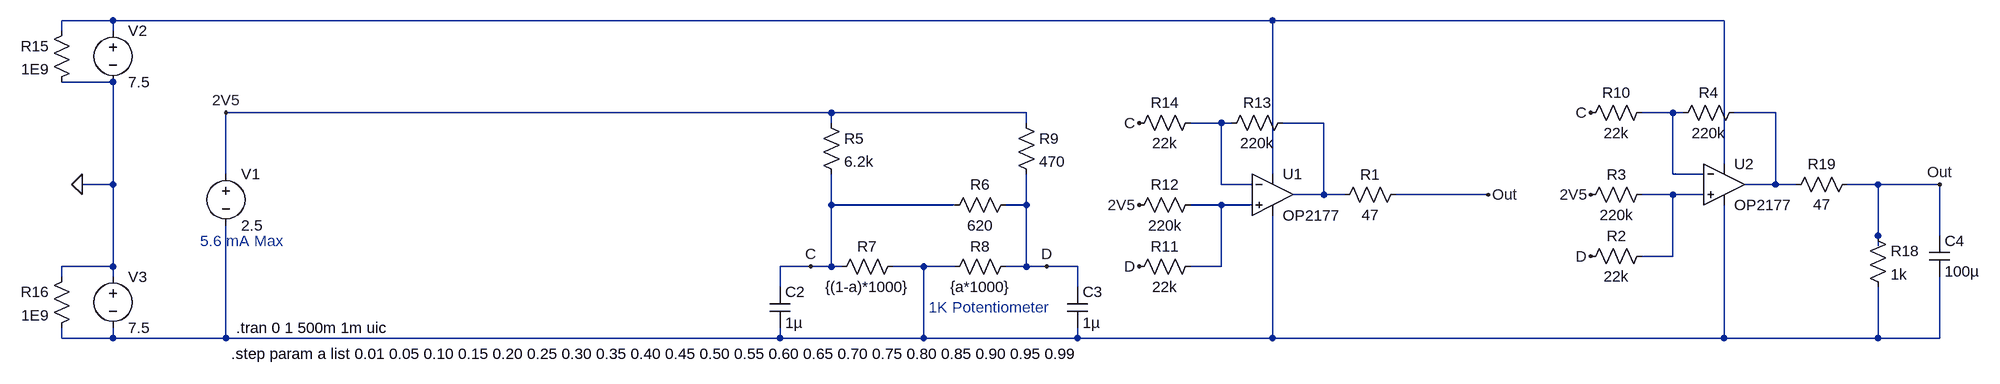
[diagram p0: schematic Bias Voltage.asc]
Bias Voltage.asc, the LTspice schematic file:
Version 4
SHEET 1 2760 680
WIRE -160 0 -240 0
WIRE 1648 0 -160 0
WIRE 2352 0 1648 0
WIRE -240 16 -240 0
WIRE -160 16 -160 0
WIRE -160 96 -240 96
WIRE 960 144 16 144
WIRE 1264 144 960 144
WIRE 2272 144 2224 144
WIRE 2288 144 2272 144
WIRE 2432 144 2368 144
WIRE 960 160 960 144
WIRE 1264 160 1264 144
WIRE 1568 160 1520 160
WIRE 1584 160 1568 160
WIRE 1728 160 1664 160
WIRE 2352 224 2352 0
WIRE 16 240 16 144
WIRE 1648 240 1648 0
WIRE 2272 240 2272 144
WIRE 2320 240 2272 240
WIRE -160 256 -160 96
WIRE -160 256 -208 256
WIRE 1568 256 1568 160
WIRE 1616 256 1568 256
WIRE 2432 256 2432 144
WIRE 2432 256 2384 256
WIRE 2464 256 2432 256
WIRE 2592 256 2544 256
WIRE 2688 256 2592 256
WIRE 1728 272 1728 160
WIRE 1728 272 1680 272
WIRE 1760 272 1728 272
WIRE 1984 272 1840 272
WIRE 2272 272 2224 272
WIRE 2320 272 2272 272
WIRE 960 288 960 240
WIRE 1152 288 960 288
WIRE 1264 288 1264 240
WIRE 1264 288 1232 288
WIRE 1568 288 1520 288
WIRE 1616 288 1568 288
WIRE 2592 336 2592 256
WIRE 2688 336 2688 256
WIRE 2592 352 2592 336
WIRE 2272 368 2272 272
WIRE 2272 368 2224 368
WIRE -160 384 -160 256
WIRE -160 384 -240 384
WIRE 928 384 880 384
WIRE 960 384 960 288
WIRE 960 384 928 384
WIRE 976 384 960 384
WIRE 1104 384 1056 384
WIRE 1152 384 1104 384
WIRE 1264 384 1264 288
WIRE 1264 384 1232 384
WIRE 1296 384 1264 384
WIRE 1344 384 1296 384
WIRE 1568 384 1568 288
WIRE 1568 384 1520 384
WIRE -240 400 -240 384
WIRE -160 400 -160 384
WIRE 880 416 880 384
WIRE 1344 416 1344 384
WIRE -240 496 -240 480
WIRE -160 496 -160 480
WIRE -160 496 -240 496
WIRE 16 496 16 320
WIRE 16 496 -160 496
WIRE 880 496 880 480
WIRE 880 496 16 496
WIRE 1104 496 1104 384
WIRE 1104 496 880 496
WIRE 1344 496 1344 480
WIRE 1344 496 1104 496
WIRE 1648 496 1648 304
WIRE 1648 496 1344 496
WIRE 2352 496 2352 288
WIRE 2352 496 1648 496
WIRE 2592 496 2592 416
WIRE 2592 496 2352 496
WIRE 2688 496 2688 400
WIRE 2688 496 2592 496
FLAG 928 384 C
FLAG 1296 384 D
FLAG 16 144 2V5
FLAG -208 256 0
FLAG 1440 288 2V5
FLAG 1440 160 C
FLAG 1440 384 D
FLAG 2144 272 2V5
FLAG 2144 144 C
FLAG 2144 368 D
FLAG 1984 272 Out
FLAG 2688 256 Out
SYMBOL voltage 16 224 R0
SYMATTR InstName V1
SYMATTR Value 2.5
SYMBOL res 944 144 R0
SYMATTR InstName R5
SYMATTR Value 6.2k
SYMBOL res 1072 368 R90
WINDOW 0 0 56 VBottom 2
WINDOW 3 32 56 VTop 2
SYMATTR InstName R7
SYMATTR Value {(1-a)*1000}
SYMBOL res 1248 368 R90
WINDOW 0 0 56 VBottom 2
WINDOW 3 32 56 VTop 2
SYMATTR InstName R8
SYMATTR Value {a*1000}
SYMBOL res 1248 144 R0
SYMATTR InstName R9
SYMATTR Value 470
SYMBOL voltage -160 0 R0
SYMATTR InstName V2
SYMATTR Value 7.5
SYMBOL voltage -160 384 R0
SYMATTR InstName V3
SYMATTR Value 7.5
SYMBOL Opamps\\OP2177 1648 208 R0
SYMATTR InstName U1
SYMBOL res 1536 368 R90
WINDOW 0 0 56 VBottom 2
WINDOW 3 32 56 VTop 2
SYMATTR InstName R11
SYMATTR Value 22k
SYMBOL res 1424 304 R270
WINDOW 0 32 56 VTop 2
WINDOW 3 0 56 VBottom 2
SYMATTR InstName R12
SYMATTR Value 220k
SYMBOL res 1568 176 R270
WINDOW 0 32 56 VTop 2
WINDOW 3 0 56 VBottom 2
SYMATTR InstName R13
SYMATTR Value 220k
SYMBOL res 1424 176 R270
WINDOW 0 32 56 VTop 2
WINDOW 3 0 56 VBottom 2
SYMATTR InstName R14
SYMATTR Value 22k
SYMBOL res 1248 272 R90
WINDOW 0 0 56 VBottom 2
WINDOW 3 32 56 VTop 2
SYMATTR InstName R6
SYMATTR Value 620
SYMBOL res -224 0 M0
SYMATTR InstName R15
SYMATTR Value 1E9
SYMBOL res -224 384 M0
SYMATTR InstName R16
SYMATTR Value 1E9
SYMBOL cap 864 416 R0
SYMATTR InstName C2
SYMATTR Value 1µ
SYMBOL cap 1328 416 R0
SYMATTR InstName C3
SYMATTR Value 1µ
SYMBOL res 1856 256 R90
WINDOW 0 0 56 VBottom 2
WINDOW 3 32 56 VTop 2
SYMATTR InstName R1
SYMATTR Value 47
SYMBOL Opamps\\OP2177 2352 192 R0
SYMATTR InstName U2
SYMBOL res 2240 352 R90
WINDOW 0 0 56 VBottom 2
WINDOW 3 32 56 VTop 2
SYMATTR InstName R2
SYMATTR Value 22k
SYMBOL res 2128 288 R270
WINDOW 0 32 56 VTop 2
WINDOW 3 0 56 VBottom 2
SYMATTR InstName R3
SYMATTR Value 220k
SYMBOL res 2272 160 R270
WINDOW 0 32 56 VTop 2
WINDOW 3 0 56 VBottom 2
SYMATTR InstName R4
SYMATTR Value 220k
SYMBOL res 2128 160 R270
WINDOW 0 32 56 VTop 2
WINDOW 3 0 56 VBottom 2
SYMATTR InstName R10
SYMATTR Value 22k
SYMBOL res 2576 320 R0
SYMATTR InstName R18
SYMATTR Value 1k
SYMBOL cap 2672 336 R0
SYMATTR InstName C4
SYMATTR Value 100µ
SYMBOL res 2560 240 R90
WINDOW 0 0 56 VBottom 2
WINDOW 3 32 56 VTop 2
SYMATTR InstName R19
SYMATTR Value 47
TEXT 32 480 Left 2 !.tran 0 1 500m 1m uic
TEXT 24 520 Left 2 !.step param a list 0.01 0.05 0.10 0.15 0.20 0.25 0.30 0.35 0.40 0.45 0.50 0.55 0.60 0.65 0.70 0.75 0.80 0.85 0.90 0.95 0.99
TEXT -24 344 Left 2 ;5.6 mA Max
TEXT 1112 448 Left 2 ;1K Potentiometer

The netlist it stands for:
* Bias Voltage.asc
V1 2V5 N008 2.5
R5 2V5 C 6.2k
R7 N008 C {(1-a)*1000}
R8 D N008 {a*1000}
R9 2V5 D 470
V2 N001 0 7.5
V3 0 N008 7.5
XU1 N007 N004 N001 N008 N005 OP2177  ; pins In+ In- V+ V- OUT
R11 N007 D 22k
R12 2V5 N007 220k
R13 N004 N005 220k
R14 C N004 22k
R6 D C 620
R15 N001 0 1E9
R16 0 N008 1E9
C2 C N008 1µ
C3 D N008 1µ
R1 Out N005 47
XU2 N006 N002 N001 N008 N003 OP2177  ; pins In+ In- V+ V- OUT
R2 N006 D 22k
R3 2V5 N006 220k
R4 N002 N003 220k
R10 C N002 22k
R18 Out N008 1k
C4 Out N008 100µ
R19 Out N003 47
.tran 0 1 500m 1m uic
.step param a list 0.01 0.05 0.10 0.15 0.20 0.25 0.30 0.35 0.40 0.45 0.50 0.55 0.60 0.65 0.70 0.75 0.80 0.85 0.90 0.95 0.99
* 5.6 mA Max
* 1K Potentiometer
.backanno
.end

* Results of the author's LTspice run, read from the files saved beside the schematic
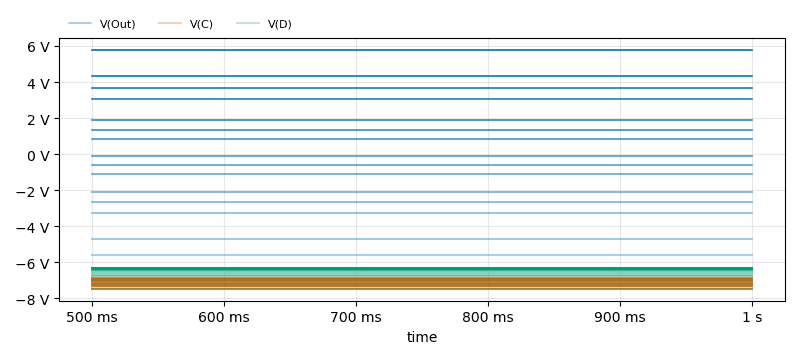
[diagram p1: Transient Analysis of Bias Voltage.asc, plotted from the saved traces]
* Transient Analysis, 21 runs:
*   V(Out) [run 1]: min -6.392 V, max -6.392 V, average -6.392 V, rms 6.392 V, last -6.392 V
*   V(Out) [run 2]: min -5.58 V, max -5.579 V, average -5.58 V, rms 5.58 V, last -5.58 V
*   V(Out) [run 3]: min -4.692 V, max -4.692 V, average -4.692 V, rms 4.692 V, last -4.692 V
*   V(Out) [run 4]: min -3.268 V, max -3.268 V, average -3.268 V, rms 3.268 V, last -3.268 V
*   V(Out) [run 5]: min -2.668 V, max -2.668 V, average -2.668 V, rms 2.668 V, last -2.668 V
*   V(Out) [run 6]: min -2.114 V, max -2.114 V, average -2.114 V, rms 2.114 V, last -2.114 V
*   V(Out) [run 7]: min -1.096 V, max -1.096 V, average -1.096 V, rms 1.096 V, last -1.096 V
*   V(Out) [run 8]: min -609.9 mV, max -609.9 mV, average -609.9 mV, rms 609.9 mV, last -609.9 mV
*   V(C) [run 1]: min -7.303 V, max -7.303 V, average -7.303 V, rms 7.303 V, last -7.303 V
*   V(C) [run 2]: min -7.198 V, max -7.198 V, average -7.198 V, rms 7.198 V, last -7.198 V
*   V(C) [run 3]: min -7.099 V, max -7.099 V, average -7.099 V, rms 7.099 V, last -7.099 V
*   V(C) [run 4]: min -6.974 V, max -6.974 V, average -6.974 V, rms 6.974 V, last -6.974 V
*   V(C) [run 5]: min -6.937 V, max -6.937 V, average -6.937 V, rms 6.937 V, last -6.937 V
*   V(C) [run 6]: min -6.913 V, max -6.913 V, average -6.913 V, rms 6.913 V, last -6.913 V
*   V(C) [run 7]: min -6.895 V, max -6.895 V, average -6.895 V, rms 6.895 V, last -6.895 V
*   V(C) [run 8]: min -6.898 V, max -6.898 V, average -6.898 V, rms 6.898 V, last -6.898 V
*   V(D) [run 1]: min -7.445 V, max -7.445 V, average -7.445 V, rms 7.445 V, last -7.445 V
*   V(D) [run 2]: min -7.253 V, max -7.253 V, average -7.253 V, rms 7.253 V, last -7.253 V
*   V(D) [run 3]: min -7.063 V, max -7.063 V, average -7.063 V, rms 7.063 V, last -7.063 V
*   V(D) [run 4]: min -6.791 V, max -6.791 V, average -6.791 V, rms 6.791 V, last -6.791 V
*   V(D) [run 5]: min -6.693 V, max -6.693 V, average -6.693 V, rms 6.693 V, last -6.693 V
*   V(D) [run 6]: min -6.612 V, max -6.612 V, average -6.612 V, rms 6.612 V, last -6.612 V
*   V(D) [run 7]: min -6.489 V, max -6.489 V, average -6.489 V, rms 6.489 V, last -6.489 V
*   V(D) [run 8]: min -6.443 V, max -6.443 V, average -6.443 V, rms 6.443 V, last -6.443 V